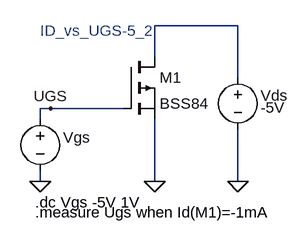
[diagram p0: schematic ID_vs_UGS-5_2.asc]
ID_vs_UGS-5_2.asc, the LTspice schematic file:
Version 4
SHEET 1 1292 680
WIRE -592 -176 -720 -176
WIRE -720 -128 -720 -176
WIRE -592 -96 -592 -176
WIRE -880 -48 -896 -48
WIRE -768 -48 -880 -48
WIRE -896 -32 -896 -48
WIRE -896 64 -896 48
WIRE -720 64 -720 -32
WIRE -592 64 -592 -16
FLAG -896 64 0
FLAG -720 64 0
FLAG -880 -48 UGS
FLAG -592 64 0
SYMBOL voltage -896 -48 R0
WINDOW 123 0 0 Left 2
WINDOW 39 40 53 Left 2
WINDOW 3 -97 181 Left 2
WINDOW 0 35 44 Left 2
SYMATTR Value ""
SYMATTR InstName Vgs
SYMBOL pmos -768 -128 R0
SYMATTR InstName M1
SYMATTR Value BSS84
SYMBOL voltage -592 -112 R0
WINDOW 123 0 0 Left 2
WINDOW 39 40 53 Left 2
WINDOW 3 35 62 Left 2
WINDOW 0 35 44 Left 2
SYMATTR Value -5V
SYMATTR InstName Vds
TEXT -904 96 Left 2 !.dc Vgs -5V 1V
TEXT -904 112 Left 2 !.measure Ugs when Id(M1)=-1mA
TEXT -896 -168 Left 2 ;ID_vs_UGS-5_2

The netlist it stands for:
* ID_vs_UGS-5_2.asc
Vgs UGS 0
M1 N001 UGS 0 0 BSS84
Vds N001 0 -5V
.model NMOS NMOS
.model PMOS PMOS
.lib standard.mos
.dc Vgs -5V 1V
.measure Ugs when Id(M1)=-1mA
* ID_vs_UGS-5_2
.backanno
.end